# Altium schematic sheet LVDS_repeater.SchDoc: SIngle channel
size 420 x 297 mm; Author: G.K.; CompanyName: WUT; DrawnBy: G.K.; Organization: CERN; Address1: Warsaw Univeristy of Technology; Address2: Nowowiejska 15/19; Revision: -; SheetNumber: -; SheetTotal: -; EDA_Number: ARTIQ; Projet: KASLI 3U subsystem; ModifiedBy: -; CreateDate: XX/XX/XXXX; CheckedDate: -; Title2: LVDS repeater; DivGrp: ISE; Designer: G.K.; ModifiedDate: -; ProjectName: KASLI 3U subsystem
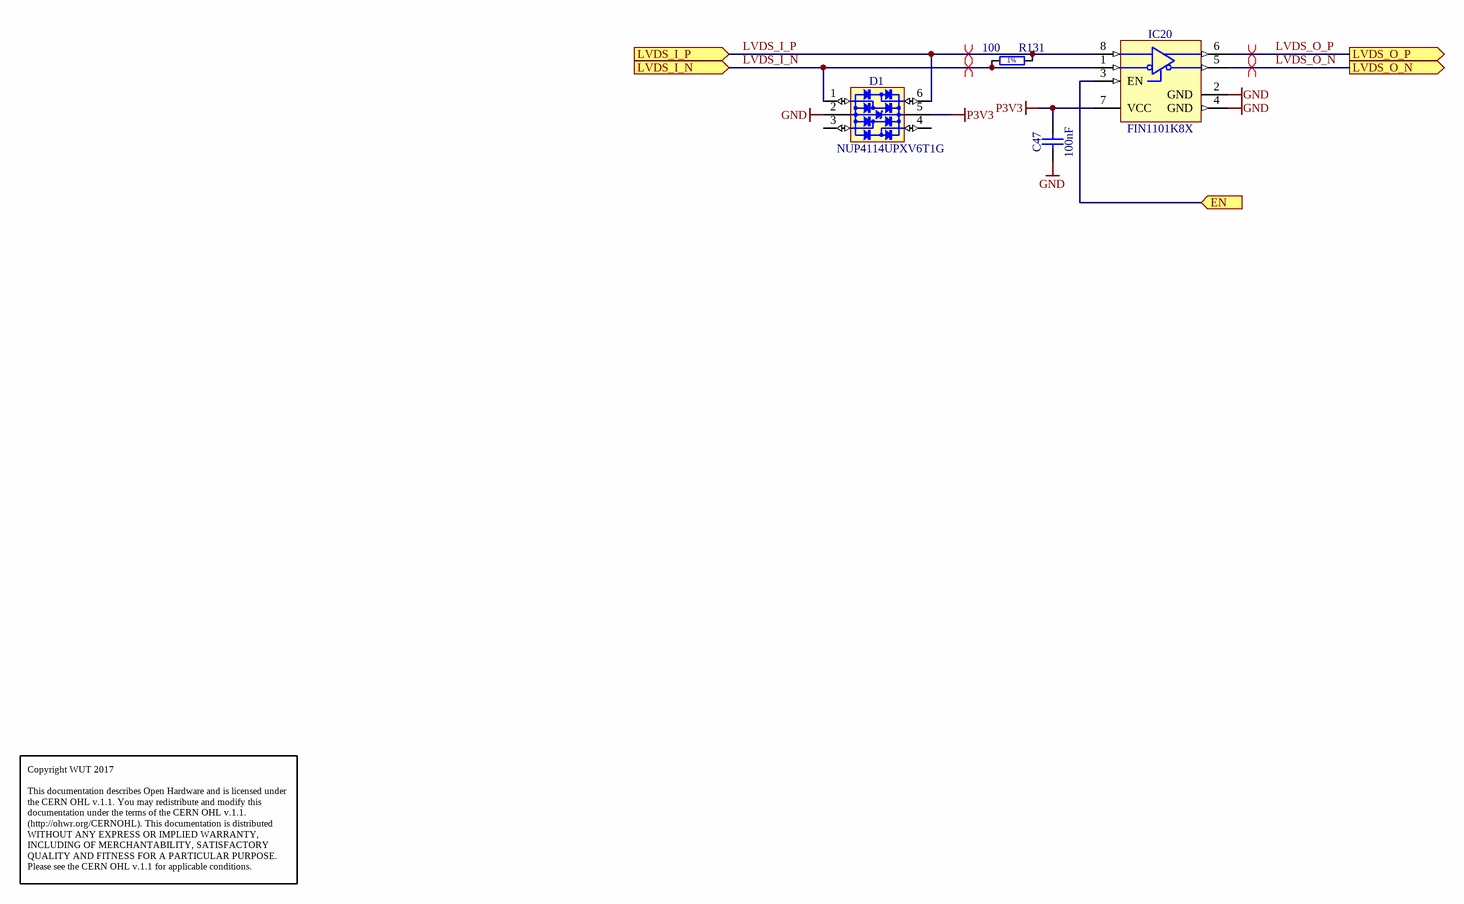
[diagram p0: LVDS_repeater.SchDoc]

## Parts
C47  100nF  [CAPC1005X55N]
D1  NUP4114UPXV6T1G  [SOTFL50P160X60-6N]
IC20  FIN1101K8X  [SOP50P310X90-8N]
R131  100  [RESC1005X40N]

## Ports
EN (in), LVDS_I_N (in), LVDS_I_P (in), LVDS_O_N (out), LVDS_O_P (out)

## Nets
GND: C47.1 D1.2(GND) IC20.2(GND) IC20.4(GND)
P3V3: C47.2 D1.5(VBUS) IC20.7(VCC)
EN: IC20.3(EN) ; port EN
LVDS_I_N: D1.1(I/O1) IC20.1(RIN-) R131.1 ; port LVDS_I_N
LVDS_I_P: D1.6(I/O4) IC20.8(RIN+) R131.2 ; port LVDS_I_P
LVDS_O_N: IC20.5(DOUT-) ; port LVDS_O_N
LVDS_O_P: IC20.6(DOUT+) ; port LVDS_O_P

Not connected (* = marked no-connect by the designer): D1 3(I/O2) 4(I/O3)

## Layout directives
differential pair: LVDS_I_N, LVDS_I_P, LVDS_O_N, LVDS_O_P

## Notes on the sheet
- Copyright WUT 2017
  This documentation describes Open Hardware and is licensed under the CERN OHL v.1.1. You may redistribute and modify this documentation under the terms of the CERN OHL v.1.1. (http://ohwr.org/CERNOHL). This documentation is distributed WITHOUT ANY EXPRESS OR IMPLIED WARRANTY, INCLUDING OF MERCHANTABILITY, SATISFACTORY QUALITY AND FITNESS FOR A PARTICULAR PURPOSE. Please see the CERN OHL v.1.1 for applicable conditions.
- Project/Equipment
- Document
- Designer
- Drawn by
- Check.by
- File
- Last Mod.
- Print Date
- Sheet
- Size
- A3
- of
- Rev
- (in symbol R0402_100R_1%_0.1W_100PPM) 1%

## Library data of the parts
C47 = CC0402_100NF_16V_10%_X5R: Non-polarised capacitor; Part Description: SMD Multilayer Chip Ceramic Capacitor; Manufacturer: GENERIC; Manufacturer1 Part Number: GRM155R61C104KA88D; Voltage: 16V; TC: X5R; Tolerance: ±10%; Part Number: CC0402_100NF_16V_10%_X5R; Component Kind: Standard; Component Type: Standard; Pin Count: 2; Value: 100nF; Status: None; Manufacturer Part Number: CC0402_100NF_16V_10%_X5R; Case: 0402; Mounted: Yes; Socket: No; SMD: Yes; Sense: No; Manufacturer1 Example: MURATA; Manufacturer1 ComponentHeight: 0.55mm; HelpURL: \\cern.ch\dfs\Applications\Altium\Datasheets\CC0402_X5R_MURATA_GRM.pdf; Author: CERN DEM JLC; CreateDate: 10.12.2013; LatestRevisionDate: 10.12.2013
D1 = NUP4114UPXV6T1G: Part Description: ESD Protection Diodes Array (8kV) with Low Clamping Voltage; Manufacturer: ON SEMICONDUCTOR; Voltage: 5.5V; PressFit: No; Bonding: No; Part Number: NUP4114UPXV6T1G; Component Kind: Standard; Component Type: Standard; Device: NUP4114UPXV6T1G; PackageDescription: SOTFL (SOT666, SOT563,), 0.50mm, Pitch; 6 Pin, 1.20mm W X 1.60mm L X 0.60mm H Body, IPC Medium Density; Manufacturer Part Number: NUP4114UPXV6T1G; Pin Count: 8; Mounted: Yes; Socket: No; SMD: Yes; Sense: No; ComponentHeight: 1.75mm; HelpURL: \\cern.ch\dfs\Applications\Altium\Datasheets\NUP4114UPXV6T1G.pdf; Author: CERN DEM JLC; CreateDate: 05.12.2012; LatestRevisionDate: 05.12.2012
IC20 = FIN1101K8X: LVDS Single Port High Speed Repeater; Manufacturer: FAIRCHILD SEMICONDUCTOR; PressFit: No; Bonding: No; Part Number: FIN1101K8X; Component Kind: Standard; Component Type: Standard; Device: FIN1101K8X; PackageDescription: SOP, 0.50mm Pitch; 8 pin, 2.30mm W X 2.00mm L X 0.90mm H body, PC Medium Density; Part Description: LVDS Single Port High Speed Repeater; Manufacturer Part Number: FIN1101K8X; Pin Count: 8; Case: TSSOP8; Mounted: Yes; Socket: No; SMD: Yes; Sense: No; ComponentHeight: 0.8mm; Author: CERN DEM JLC; HelpURL: \\cern.ch\dfs\Applications\Altium\Datasheets\FIN1101K8X.pdf; CreateDate: 08.11.2016; LatestRevisionDate: 08.11.2016
R131 = R0402_100R_1%_0.1W_100PPM: Resistor - 1%; Part Description: General Purpose Thick Film Chip Resistor; Manufacturer: GENERIC; Manufacturer Part Number: R0402_100R_1%_0.1W_100PPM_50V; Manufacturer1 Part Number: ERJ2RKF1000X; Power: 0.1W; TC: ±100ppm/°C; Voltage: 50V; Part Number: R0402_100R_1%_0.1W_100PPM; Component Kind: Standard; Component Type: Standard; Pin Count: 2; Value: 100; Status: Not recommended; Tolerance: ±1%; Case: 0402; Mounted: Yes; Sense: No; Socket: No; SMD: Yes; Manufacturer1 Example: PANASONIC; Manufacturer1 ComponentHeight: 0.4mm; HelpURL: \\cern.ch\dfs\Applications\Altium\Datasheets\R0402_PANASONIC_ERJ2RK.pdf; Author: CERN DEM JLC; CreateDate: 12.12.2013; LatestRevisionDate: 03.03.2015